# Altium schematic sheet Displays.SchDoc
size A4; SheetNumber: 3; SheetTotal: 3
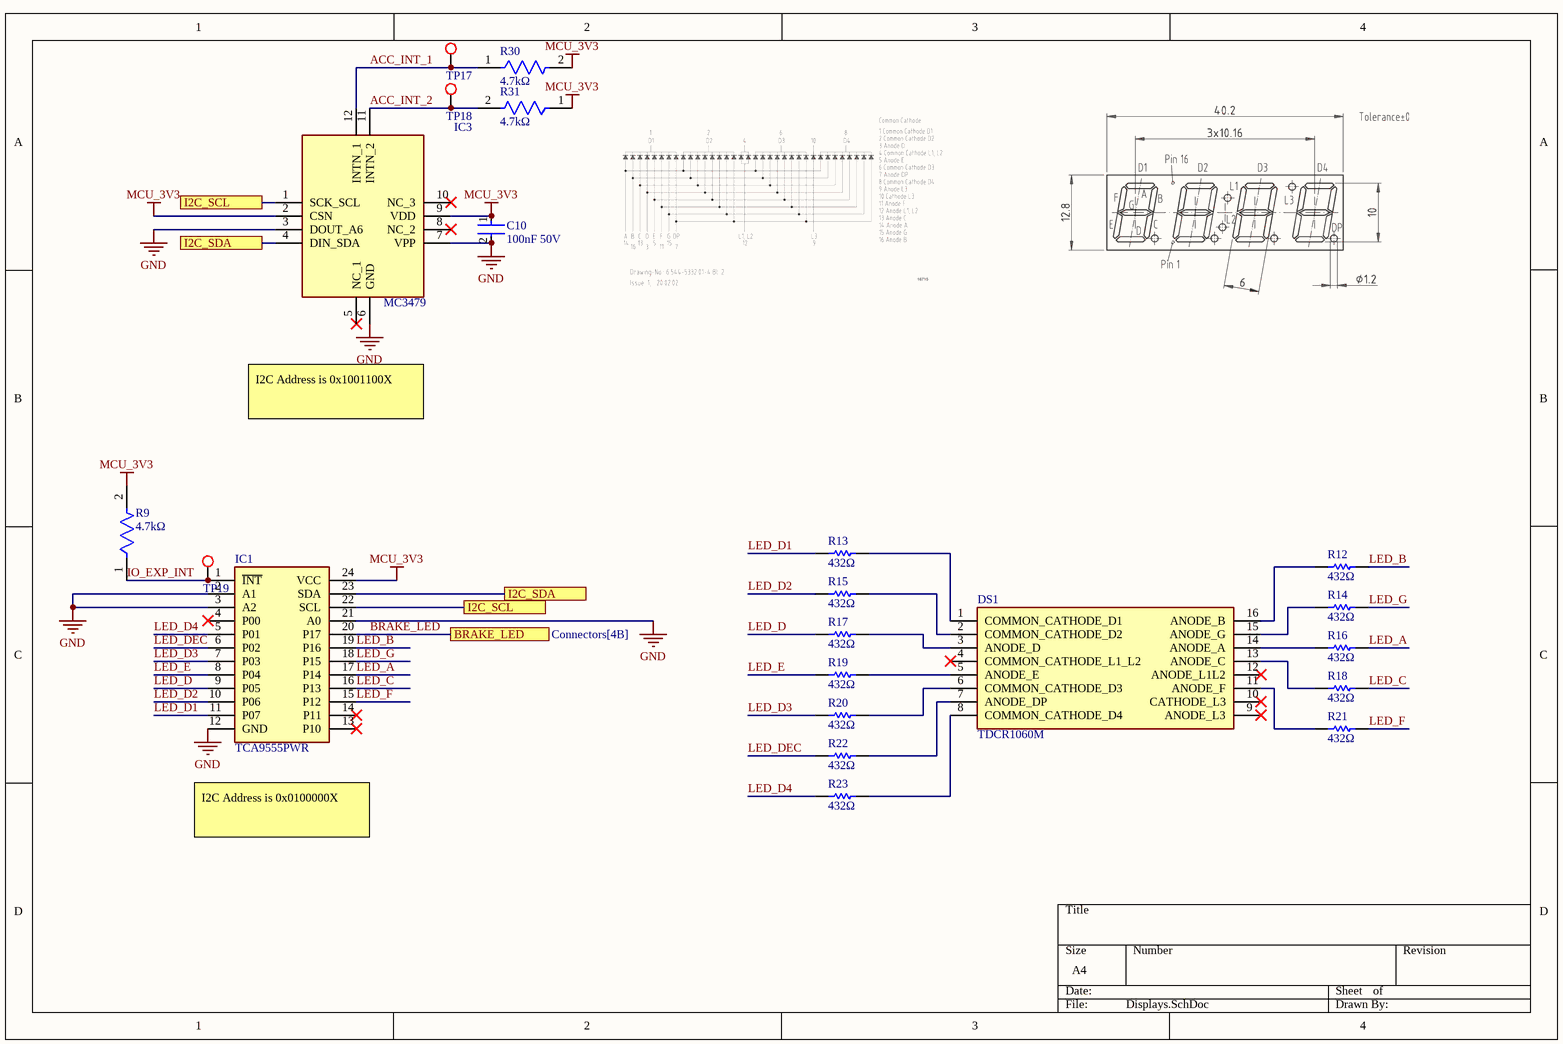
[diagram p0: Displays.SchDoc]

## Parts
C10  100nF 50V  [FP-CL31-IPC_C]
DS1  TDCR1060M  [DIPS1016W50P254L4020H725Q16N]
IC1  TCA9555PWR  [SOP65P640X120-24N]
IC3  MC3479  [MC3479]
R9  4.7kΩ  [FP-RT0805-MFG]
R12  432Ω  [RESC2013X50X30NL20T20]
R13  432Ω  [RESC2013X50X30NL20T20]
R14  432Ω  [RESC2013X50X30NL20T20]
R15  432Ω  [RESC2013X50X30NL20T20]
R16  432Ω  [RESC2013X50X30NL20T20]
R17  432Ω  [RESC2013X50X30NL20T20]
R18  432Ω  [RESC2013X50X30NL20T20]
R19  432Ω  [RESC2013X50X30NL20T20]
R20  432Ω  [RESC2013X50X30NL20T20]
R21  432Ω  [RESC2013X50X30NL20T20]
R22  432Ω  [RESC2013X50X30NL20T20]
R23  432Ω  [RESC2013X50X30NL20T20]
R30  4.7kΩ  [FP-RT0805-MFG]
R31  4.7kΩ  [FP-RT0805-MFG]
TP17  TP  [Testpoint]  (value not drawn)
TP18  TP  [Testpoint]  (value not drawn)
TP19  TP  [Testpoint]  (value not drawn)

## Ports
BRAKE_LED (see Connectors[4B]), I2C_SCL (see Connectors[1B], Displays[1A]), I2C_SCL (see Connectors[1B], Displays[2C]), I2C_SDA (see Connectors[1B], Displays[1A]), I2C_SDA (see Connectors[1B], Displays[2C])

## Nets
GND: C10.2 IC1.2(A1) IC1.3(A2) IC1.12(GND) IC1.21(A0) IC3.3(DOUT_A6) IC3.6(GND) IC3.7(VPP)
MCU_3V3: C10.1 IC1.24(VCC) IC3.2(CSN) IC3.9(VDD) R9.2 R30.2 R31.1
ACC_INT_1: IC3.12(INTN_1) R30.1 TP17.0
ACC_INT_2: IC3.11(INTN_2) R31.2 TP18.0
BRAKE_LED: IC1.20(P17) ; port BRAKE_LED
I2C_SCL: IC1.22(SCL) IC3.1(SCK_SCL) ; port I2C_SCL
I2C_SDA: IC1.23(SDA) IC3.4(DIN_SDA) ; port I2C_SDA
IO_EXP_INT: IC1.1(~{INT}) R9.1 TP19.0
LED_A: IC1.17(P14) R16.2
LED_B: IC1.19(P16) R12.2
LED_C: IC1.16(P13) R18.2
LED_D: IC1.9(P05) R17.1
LED_D1: IC1.11(P07) R13.1
LED_D2: IC1.10(P06) R15.1
LED_D3: IC1.7(P03) R20.1
LED_D4: IC1.5(P01) R23.1
LED_DEC: IC1.6(P02) R22.1
LED_E: IC1.8(P04) R19.1
LED_F: IC1.15(P12) R21.2
LED_G: IC1.18(P15) R14.2
NetDS1_1: DS1.1(COMMON_CATHODE_D1) R13.2
NetDS1_2: DS1.2(COMMON_CATHODE_D2) R15.2
NetDS1_3: DS1.3(ANODE_D) R17.2
NetDS1_5: DS1.5(ANODE_E) R19.2
NetDS1_6: DS1.6(COMMON_CATHODE_D3) R20.2
NetDS1_7: DS1.7(ANODE_DP) R22.2
NetDS1_8: DS1.8(COMMON_CATHODE_D4) R23.2
NetDS1_11: DS1.11(ANODE_F) R21.1
NetDS1_13: DS1.13(ANODE_C) R18.1
NetDS1_14: DS1.14(ANODE_A) R16.1
NetDS1_15: DS1.15(ANODE_G) R14.1
NetDS1_16: DS1.16(ANODE_B) R12.1

Not connected (* = marked no-connect by the designer): DS1 4(COMMON_CATHODE_L1_L2)* 9(ANODE_L3)* 10(CATHODE_L3)* 12(ANODE_L1L2)*; IC1 4(P00)* 13(P10)* 14(P11)*; IC3 5(NC_1)* 8(NC_2)* 10(NC_3)*

## Notes on the sheet
- I2C Address is 0x1001100X
- I2C Address is 0x0100000X

## Library data of the parts
C10 = CMP-13271-001276-1: Cap Ceramic 100nF 50V X7R ±10% SMD 1206 +125°C Embossed T/R; Dielectric: X7R; Case Code (Metric): 3216; Package Quantity: 1; Thickness: 0.037inch; Depth: 1.6mm; Packaging: Tape and Reel; Capacitance: 100nF; Length: 0.126inch; Tolerance: 10%; Voltage Rating: 50V; Case Code (Imperial): 1206; Radiation Hardening: No; Width: 0.063inch; Case/Package: 1206; Max Operating Temperature: 125°C; Min Operating Temperature: -55°C; Height: 0.85mm; Mount: Surface Mount
DS1 = TDCR1060M: Display; Manufacturer_Name: Vishay; Datasheet Link: https://www.vishay.com/docs/83180/tdcx10x0m.pdf; Height: 7.25mm; Manufacturer_Part_Number: TDCR1060M; Mouser Part Number: 78-TDCR1060M; Mouser Price/Stock: https://www.mouser.co.uk/ProductDetail/Vishay-Semiconductors/TDCR1060M?qs=RzxYCzJDjPUXs69EkIPw9Q%3D%3D
IC1 = TCA9555PWR: Integrated Circuit; Manufacturer_Name: Texas Instruments; Datasheet Link: https://www.ti.com/lit/gpn/TCA9555; Height: 1.2mm; Manufacturer_Part_Number: TCA9555PWR; Mouser Part Number: 595-TCA9555PWR; Mouser Price/Stock: https://www.mouser.co.uk/ProductDetail/Texas-Instruments/TCA9555PWR?qs=O3wcJz4o8IeDwg4St4nEYQ%3D%3D; Arrow Part Number: TCA9555PWR; Arrow Price/Stock: https://www.arrow.com/en/products/tca9555pwr/texas-instruments?region=nac
IC3 = MC3479: Integrated Circuit; Manufacturer_Name: MEMSIC; Description: Accelerometers Small Digital 3-axis Accelerometer Sensor; Datasheet Link: http://www.memsic.com/uploadfiles/2020/08/20200827164636363.pdf; Height: 1mm; Manufacturer_Part_Number: MC3479; Mouser Part Number: 498-MC3479; Mouser Price/Stock: https://www.mouser.co.uk/ProductDetail/MEMSIC/MC3479?qs=OlC7AqGiEDmYmlaMvA9fTA%3D%3D; Arrow Part Number: MC3479; Arrow Price/Stock: null?region=nac
R9 R30 R31 = CMP-03412-019393-1: RES SMD 4.7K OHM 1% 1/8W 0805; Manufacturer Part Number: RT0805FRE074K7L; Manufacturer: Yageo; Tolerance: 0.0001; Power Rating: 0.125W; Voltage Rating: 150V; Temperature Coefficient: 50 ppm/°C; Device Class L1: Passive Components; Category: Res; Temperature Range Low: -55°C; Device Class L2: Resistors; Ipc Land Pattern Name: RESC200125X50; Package: RT0805; Device Class L3: Chip SMD Resistors; Temperature: -55°C to +155°C; ComponentLink2Description: Datasheet; Footprint Url: http://www.yageo.com/exep/pages/download/literatures/PYu-R_Mount_10.pdf; Series: RT; Mouser Description: Thin Film Resistors - SMD 1/8W 4.7K ohm 1% 50ppm; Height: 0.6mm; Resistance: 4.7KΩ; Octopart: https://octopart.com/rt0805fre074k7l-yageo-40047233; Value: 4.7KΩ; Digikey Description: RES SMD 4.7K OHM 1% 1/8W 0805; Composition: Thin Film; Automotive: No; Temperature Range High: +155°C; Lead Free: Yes; ComponentLink2URL: http://www.yageo.com/documents/recent/PYu-RT_1-to-0.01_RoHS_L_9.pdf; RoHS: TRUE
R12-R23 = CMP-2001-03914-1: Part Number: CRCW0805432RFKEA; Manufacturer: Vishay Dale
TP17-TP19 = Testpoint